# EAGLE design top board (EAGLE 7.6.0)
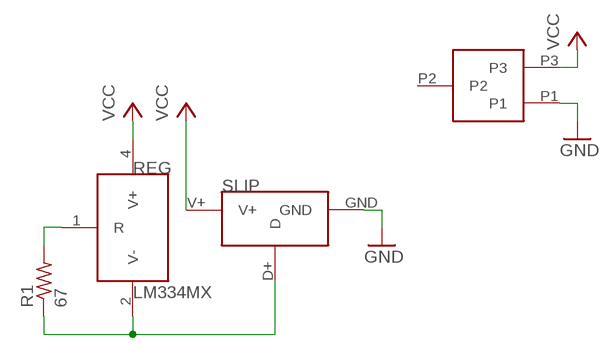
[diagram p0: schematic, sheet 1]

## Parts
R1  67  R-US_R0603  [R0603]
REG  LM334MX  [8-SOIC]
SLIP  RING  [RING]
U$2  AVX_CONN  [AVX_CONN]

## Nets
GND: SLIP.GND U$2.P1
N$8: R1.2 REG.1(R)
N$9: R1.1 REG.2(V-) SLIP.D+(D)
VCC: REG.4(V+) SLIP.V+ U$2.P3
Unconnected: U$2.P2

## Library data of the parts
R1 = resistor:R-US_: RESISTOR, American symbol
REG = CUSTOM:LM334MX
SLIP = CUSTOM:RING
U$2 = CUSTOM:AVX_CONN

## Board
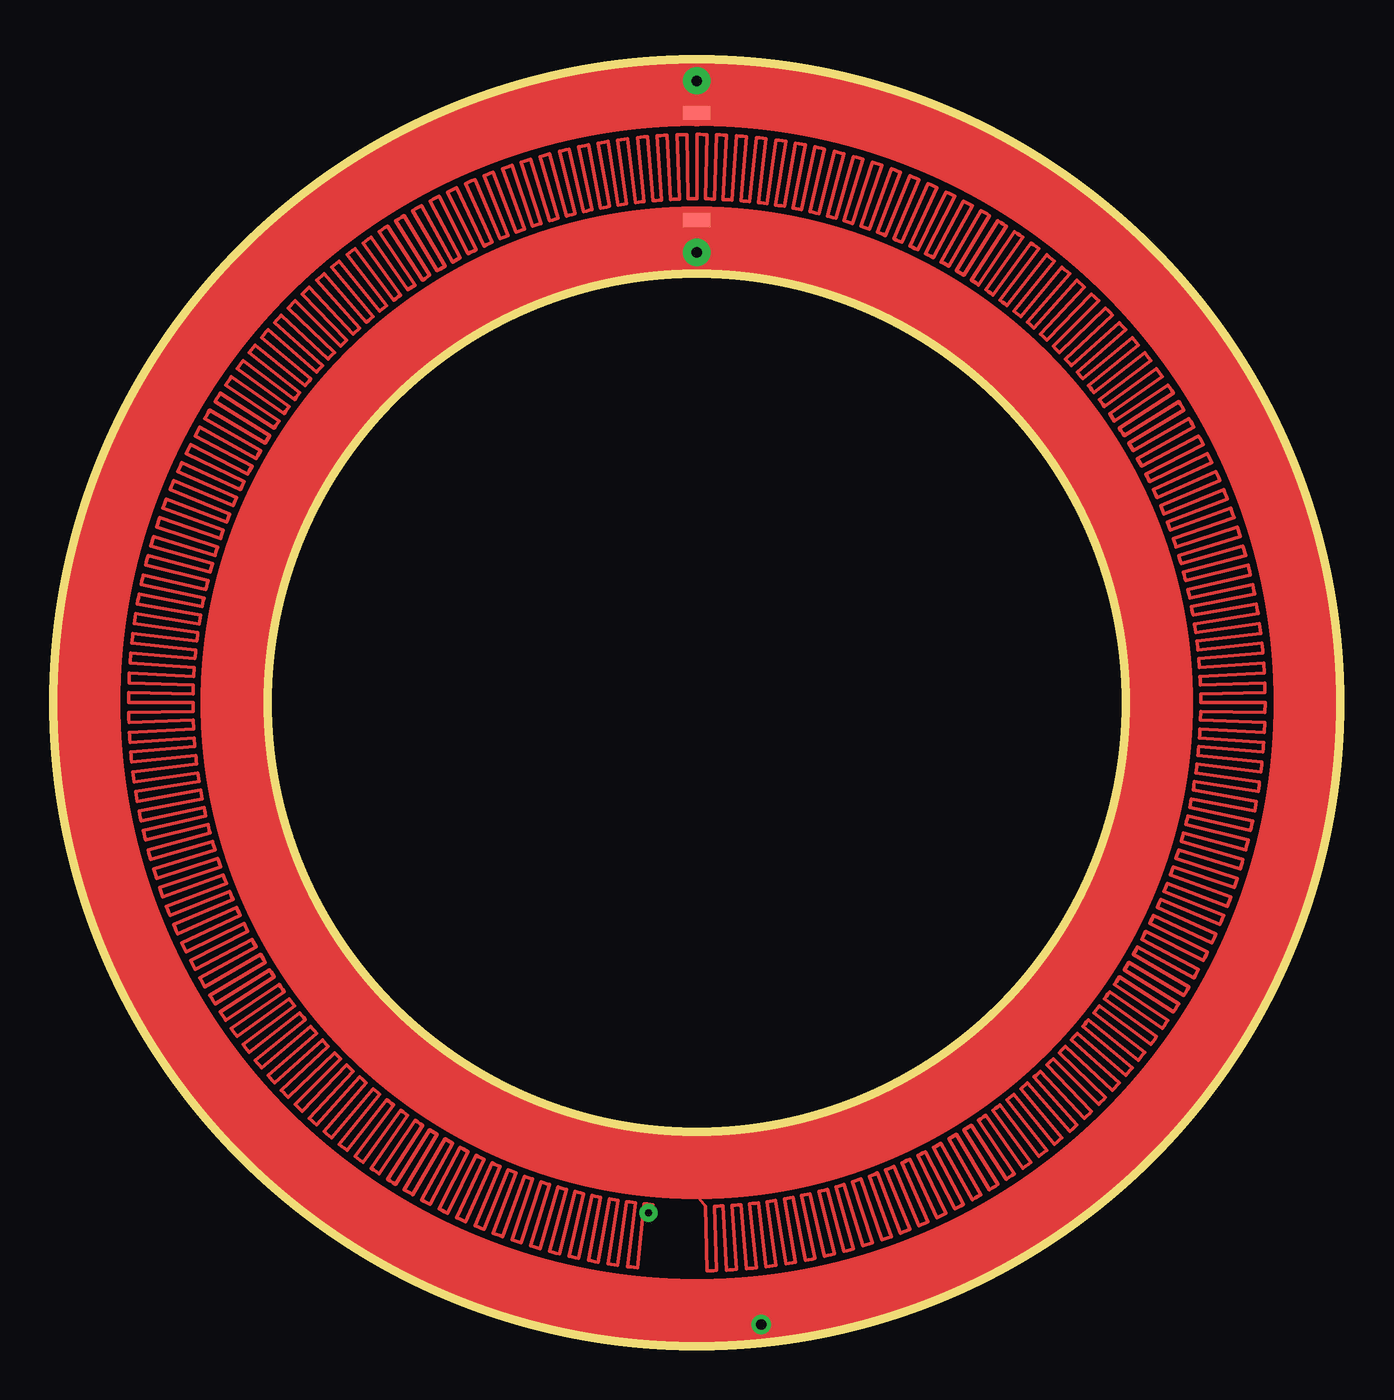
[diagram p1: board, top side]
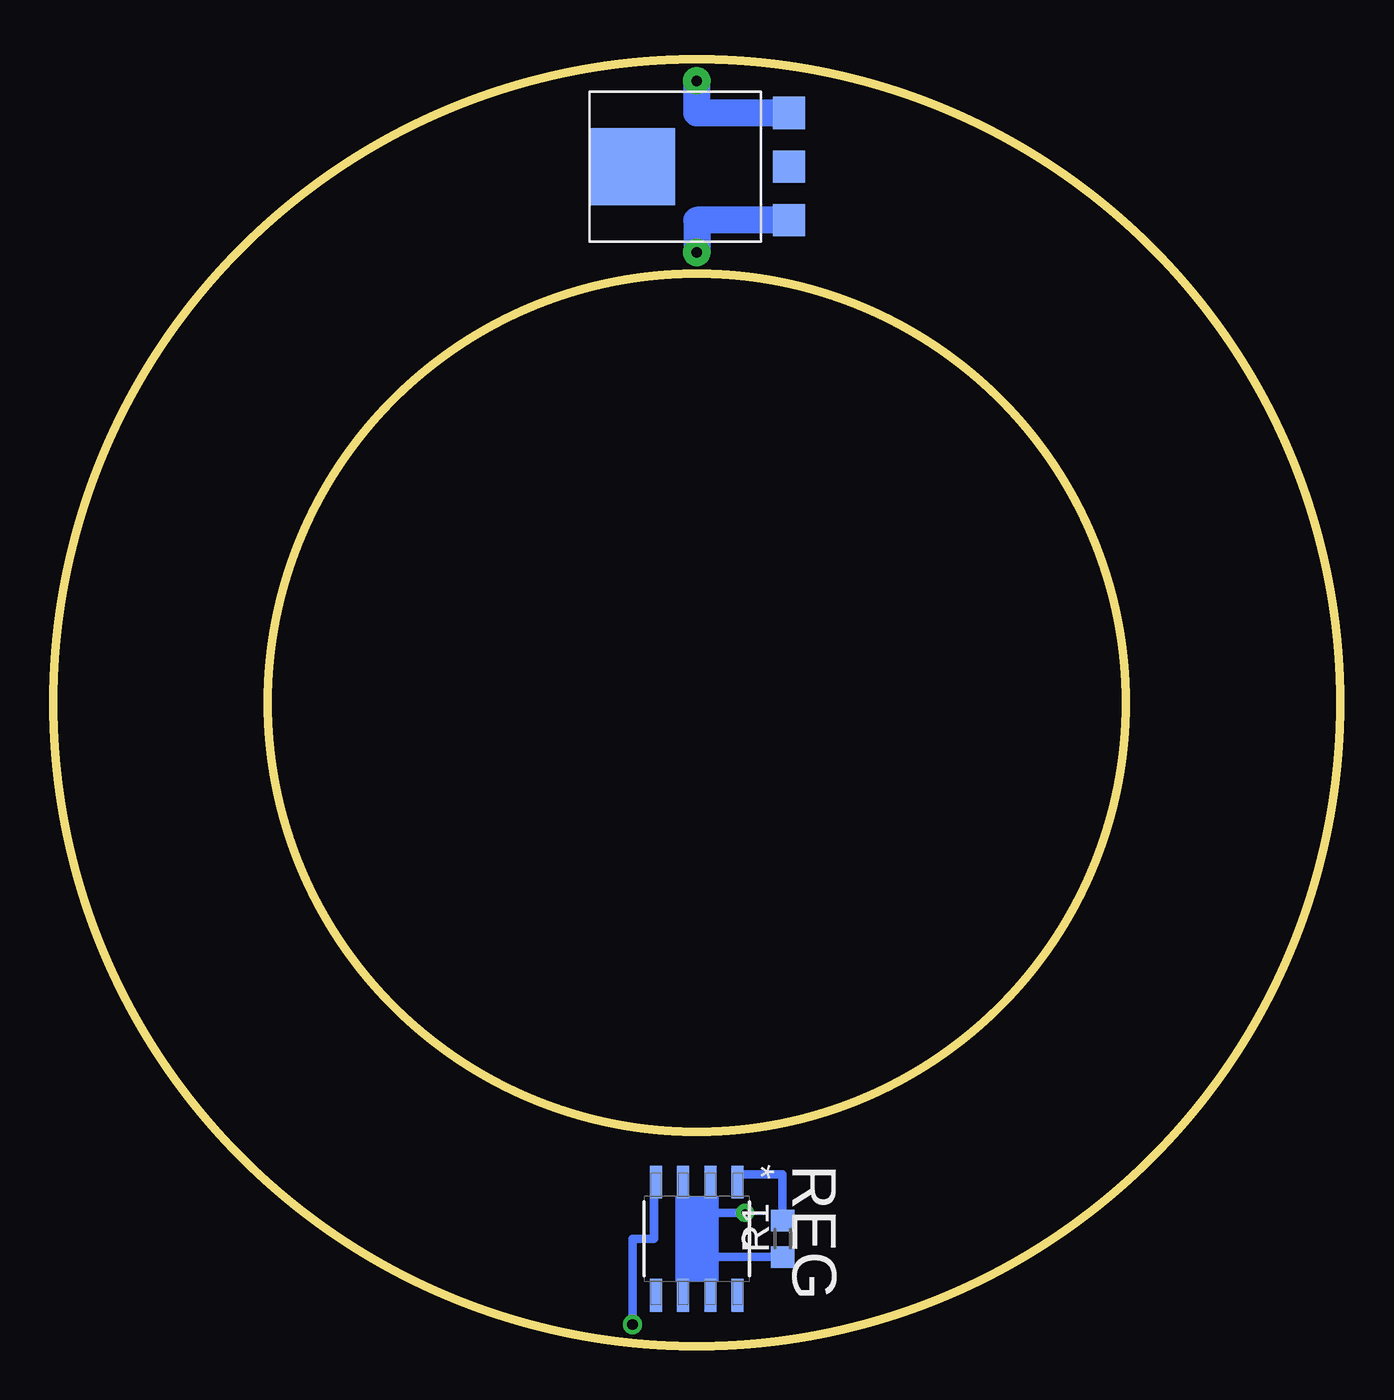
[diagram p2: board, bottom side, seen from below]

Size 60 x 60 mm. Coordinates in mm from the lower left corner, seen from the top.
Outline: circle at 30,30 radius 30
Outline: circle at 30,30 radius 20
Copper layers (1*16): Top 0.035mm / dielectric 1.5mm / Bottom 0.035mm
Design rules "default": minimum track width 10mil, minimum drill 24mil, track to track 8mil, track to pad 8mil, pad to pad 8mil, via to via 8mil, smd to smd 8mil, copper to edge 40mil, drill to drill 8mil, minimum pad ring 10mil, minimum via ring 8mil, stop-mask expansion 4mil, vias tented up to drill 0mil, thermal gap 10mil

### Footprints (pad centres in the part's own frame; a part is rotated, then mirrored left to right if it is on the bottom)
R0603 = smd 1 x 1.1: 1 -0.85,0; 2 0.85,0
8-SOIC = smd 1.524 x 0.559: 1 -2.642,1.905; 2 -2.642,0.635; 3 -2.642,-0.635; 4 -2.642,-1.905; 5 2.642,-1.905; 6 2.642,-0.635; 7 2.642,0.635; 8 2.642,1.905
RING = drill 0.33 pad 0.686: D+ -2.25,-23.8 | smd 1.27 x 0.635: GND 0,22.5; V+ 0,27.5
AVX_CONN = smd 1.5 x 1.5: P1 -2.5,-4.3; P2 0,-4.3; P3 2.5,-4.3 | smd 3.6 x 3.95: P$2 0,3

### Placement (x,y rotation side)
R1  26,5 90 bottom
REG  30,5 270 bottom
SLIP  30,30 0 top
U$2  30,55 90 bottom

### Tracks (layer width: path | path; a pad name or v marks a point on that pad's centre or on a via)
GND  (via drill 0.5 pad 1.27)
  Top 1.27: v30,51 SLIP.GND
  Bottom 1.27: U$2.P1 SLIP.GND v30,51
N$8
  Bottom 0.406: R1.2 26,8 28.09,8 REG.1
N$9
  Bottom 0.406: R1.1 29.36,4.15 29.36,6.2 | REG.2 29.36,7 29.36,6.2 | SLIP.D+ 29.36,6.2
VCC  (via drill 0.5, 0.5 pad 1.27)
  Top 0.406: v33,1 30,2.5 arc90 57.65,30.15 57.65,30.25 arc90 30.4,57.5 SLIP.V+
  Top 1.27: v30,59 SLIP.V+
  Bottom 0.406: REG.4 32,7.64 32,5 33,5 v33,1
  Bottom 1.27: U$2.P3 SLIP.V+ v30,59
(copper drawn outside any net)
  shapes: Bottom area x1, Top circle x2